# Altium schematic sheet A7_FUNCTION3 - Ⅱ.SchDoc
size A3
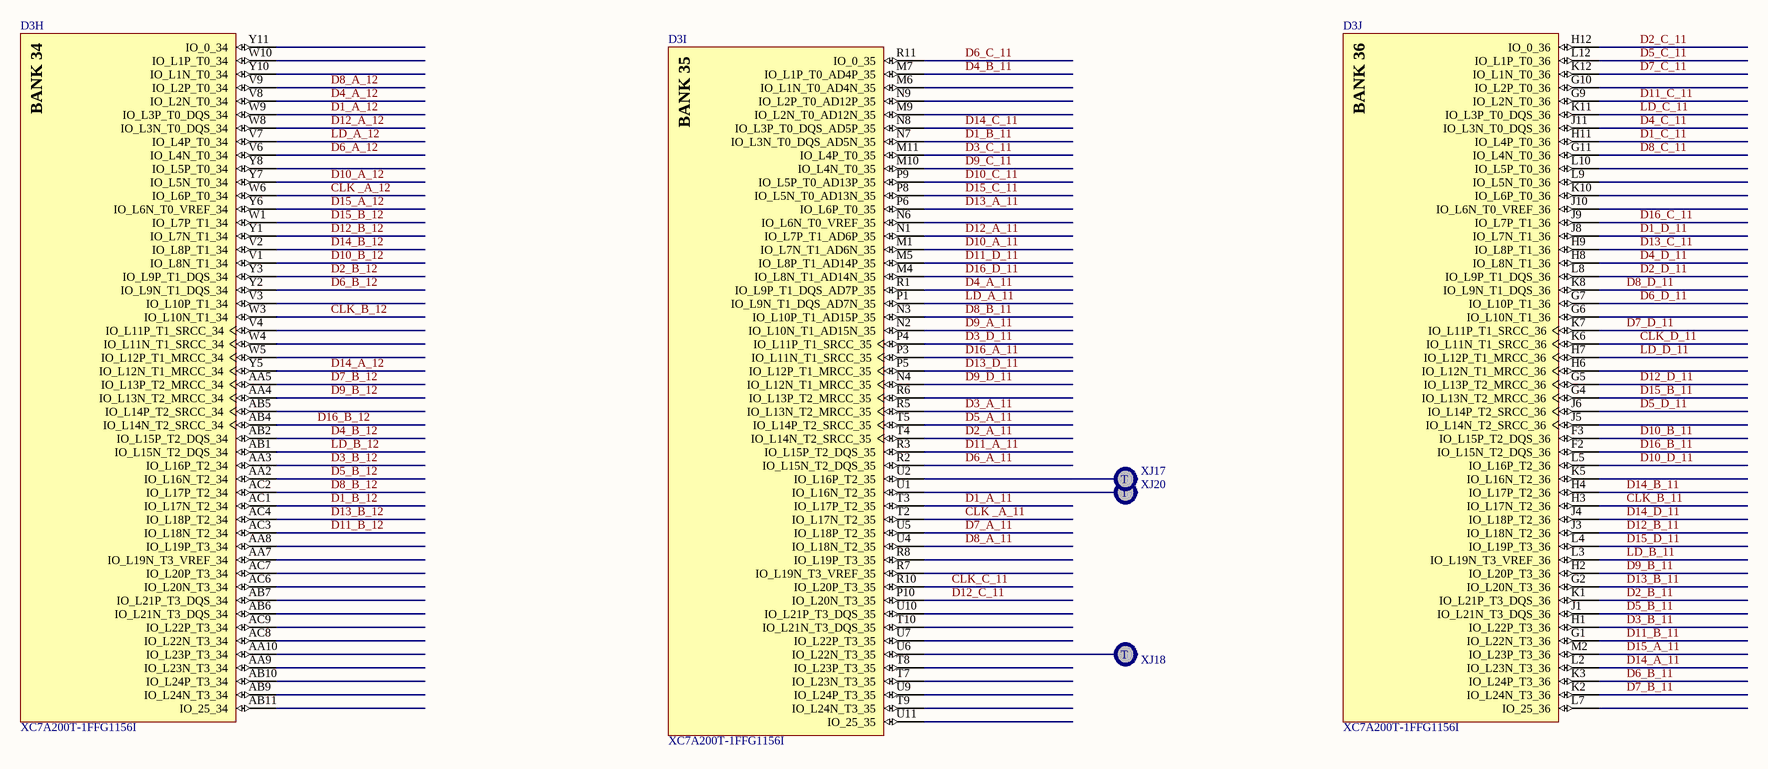
[diagram p0: A7_FUNCTION3 - Ⅱ.SchDoc]

## Parts
D3  XC7A200T-1FFG1156I  [FFG1156]  (parts H,I,J of 18)
XJ17  TESTPOINT  [TEST-pin]  (value not drawn)
XJ18  TESTPOINT  [TEST-pin]  (value not drawn)
XJ20  TESTPOINT  [TEST-pin]  (value not drawn)

## Nets
CLK _A_11: D3.T2(IO_L17N_T2_35)
CLK _A_12: D3.W6(IO_L6P_T0_34)
CLK_B_11: D3.H3(IO_L17N_T2_36)
CLK_B_12: D3.W3(IO_L10N_T1_34)
CLK_C_11: D3.R10(IO_L20P_T3_35)
CLK_D_11: D3.K6(IO_L11N_T1_SRCC_36)
D1_A_11: D3.T3(IO_L17P_T2_35)
D1_A_12: D3.W9(IO_L3P_T0_DQS_34)
D1_B_11: D3.N7(IO_L3N_T0_DQS_AD5N_35)
D1_B_12: D3.AC1(IO_L17N_T2_34)
D1_C_11: D3.H11(IO_L4P_T0_36)
D1_D_11: D3.J8(IO_L7N_T1_36)
D2_A_11: D3.T4(IO_L14N_T2_SRCC_35)
D2_B_11: D3.K1(IO_L21P_T3_DQS_36)
D2_B_12: D3.Y3(IO_L9P_T1_DQS_34)
D2_C_11: D3.H12(IO_0_36)
D2_D_11: D3.L8(IO_L9P_T1_DQS_36)
D3_A_11: D3.R5(IO_L13N_T2_MRCC_35)
D3_B_11: D3.H1(IO_L22P_T3_36)
D3_B_12: D3.AA3(IO_L16P_T2_34)
D3_C_11: D3.M11(IO_L4P_T0_35)
D3_D_11: D3.P4(IO_L11P_T1_SRCC_35)
D4_A_11: D3.R1(IO_L9P_T1_DQS_AD7P_35)
D4_A_12: D3.V8(IO_L2N_T0_34)
D4_B_11: D3.M7(IO_L1P_T0_AD4P_35)
D4_B_12: D3.AB2(IO_L15P_T2_DQS_34)
D4_C_11: D3.J11(IO_L3N_T0_DQS_36)
D4_D_11: D3.H8(IO_L8N_T1_36)
D5_A_11: D3.T5(IO_L14P_T2_SRCC_35)
D5_B_11: D3.J1(IO_L21N_T3_DQS_36)
D5_B_12: D3.AA2(IO_L16N_T2_34)
D5_C_11: D3.L12(IO_L1P_T0_36)
D5_D_11: D3.J6(IO_L14P_T2_SRCC_36)
D6_A_11: D3.R2(IO_L15N_T2_DQS_35)
D6_A_12: D3.V6(IO_L4N_T0_34)
D6_B_11: D3.K3(IO_L24P_T3_36)
D6_B_12: D3.Y2(IO_L9N_T1_DQS_34)
D6_C_11: D3.R11(IO_0_35)
D6_D_11: D3.G7(IO_L10P_T1_36)
D7_A_11: D3.U5(IO_L18P_T2_35)
D7_B_11: D3.K2(IO_L24N_T3_36)
D7_B_12: D3.AA5(IO_L13P_T2_MRCC_34)
D7_C_11: D3.K12(IO_L1N_T0_36)
D7_D_11: D3.K7(IO_L11P_T1_SRCC_36)
D8_A_11: D3.U4(IO_L18N_T2_35)
D8_A_12: D3.V9(IO_L2P_T0_34)
D8_B_11: D3.N3(IO_L10P_T1_AD15P_35)
D8_B_12: D3.AC2(IO_L17P_T2_34)
D8_C_11: D3.G11(IO_L4N_T0_36)
D8_D_11: D3.K8(IO_L9N_T1_DQS_36)
D9_A_11: D3.N2(IO_L10N_T1_AD15N_35)
D9_B_11: D3.H2(IO_L20P_T3_36)
D9_B_12: D3.AA4(IO_L13N_T2_MRCC_34)
D9_C_11: D3.M10(IO_L4N_T0_35)
D9_D_11: D3.N4(IO_L12N_T1_MRCC_35)
D10_A_11: D3.M1(IO_L7N_T1_AD6N_35)
D10_A_12: D3.Y7(IO_L5N_T0_34)
D10_B_11: D3.F3(IO_L15P_T2_DQS_36)
D10_B_12: D3.V1(IO_L8N_T1_34)
D10_C_11: D3.P9(IO_L5P_T0_AD13P_35)
D10_D_11: D3.L5(IO_L16P_T2_36)
D11_A_11: D3.R3(IO_L15P_T2_DQS_35)
D11_B_11: D3.G1(IO_L22N_T3_36)
D11_B_12: D3.AC3(IO_L18N_T2_34)
D11_C_11: D3.G9(IO_L2N_T0_36)
D11_D_11: D3.M5(IO_L8P_T1_AD14P_35)
D12_A_11: D3.N1(IO_L7P_T1_AD6P_35)
D12_A_12: D3.W8(IO_L3N_T0_DQS_34)
D12_B_11: D3.J3(IO_L18N_T2_36)
D12_B_12: D3.Y1(IO_L7N_T1_34)
D12_C_11: D3.P10(IO_L20N_T3_35)
D12_D_11: D3.G5(IO_L13P_T2_MRCC_36)
D13_A_11: D3.P6(IO_L6P_T0_35)
D13_B_11: D3.G2(IO_L20N_T3_36)
D13_B_12: D3.AC4(IO_L18P_T2_34)
D13_C_11: D3.H9(IO_L8P_T1_36)
D13_D_11: D3.P5(IO_L12P_T1_MRCC_35)
D14_A_11: D3.L2(IO_L23N_T3_36)
D14_A_12: D3.Y5(IO_L12N_T1_MRCC_34)
D14_B_11: D3.H4(IO_L17P_T2_36)
D14_B_12: D3.V2(IO_L8P_T1_34)
D14_C_11: D3.N8(IO_L3P_T0_DQS_AD5P_35)
D14_D_11: D3.J4(IO_L18P_T2_36)
D15_A_11: D3.M2(IO_L23P_T3_36)
D15_A_12: D3.Y6(IO_L6N_T0_VREF_34)
D15_B_11: D3.G4(IO_L13N_T2_MRCC_36)
D15_B_12: D3.W1(IO_L7P_T1_34)
D15_C_11: D3.P8(IO_L5N_T0_AD13N_35)
D15_D_11: D3.L4(IO_L19P_T3_36)
D16_A_11: D3.P3(IO_L11N_T1_SRCC_35)
D16_B_11: D3.F2(IO_L15N_T2_DQS_36)
D16_B_12: D3.AB4(IO_L14N_T2_SRCC_34)
D16_C_11: D3.J9(IO_L7P_T1_36)
D16_D_11: D3.M4(IO_L8N_T1_AD14N_35)
LD_A_11: D3.P1(IO_L9N_T1_DQS_AD7N_35)
LD_A_12: D3.V7(IO_L4P_T0_34)
LD_B_11: D3.L3(IO_L19N_T3_VREF_36)
LD_B_12: D3.AB1(IO_L15N_T2_DQS_34)
LD_C_11: D3.K11(IO_L3P_T0_DQS_36)
LD_D_11: D3.H7(IO_L12P_T1_MRCC_36)
NetD3_U1: D3.U1(IO_L16N_T2_35) XJ20.1(T)
NetD3_U2: D3.U2(IO_L16P_T2_35) XJ17.1(T)
NetD3_U6: D3.U6(IO_L22N_T3_35) XJ18.1(T)

Not connected (* = marked no-connect by the designer): D3 AA7(IO_L19N_T3_VREF_34) AA8(IO_L19P_T3_34) AA9(IO_L23N_T3_34) AA10(IO_L23P_T3_34) AB5(IO_L14P_T2_SRCC_34) AB6(IO_L21N_T3_DQS_34) AB7(IO_L21P_T3_DQS_34) AB9(IO_L24N_T3_34) AB10(IO_L24P_T3_34) AB11(IO_25_34) AC6(IO_L20N_T3_34) AC7(IO_L20P_T3_34) AC8(IO_L22N_T3_34) AC9(IO_L22P_T3_34) G6(IO_L10N_T1_36) G10(IO_L2P_T0_36) H6(IO_L12N_T1_MRCC_36) J5(IO_L14N_T2_SRCC_36) J10(IO_L6N_T0_VREF_36) K5(IO_L16N_T2_36) K10(IO_L6P_T0_36) L7(IO_25_36) L9(IO_L5N_T0_36) L10(IO_L5P_T0_36) M6(IO_L1N_T0_AD4N_35) M9(IO_L2N_T0_AD12N_35) N6(IO_L6N_T0_VREF_35) N9(IO_L2P_T0_AD12P_35) R6(IO_L13P_T2_MRCC_35) R7(IO_L19N_T3_VREF_35) R8(IO_L19P_T3_35) T7(IO_L23N_T3_35) T8(IO_L23P_T3_35) T9(IO_L24N_T3_35) T10(IO_L21N_T3_DQS_35) U7(IO_L22P_T3_35) U9(IO_L24P_T3_35) U10(IO_L21P_T3_DQS_35) U11(IO_25_35) V3(IO_L10P_T1_34) V4(IO_L11P_T1_SRCC_34) W4(IO_L11N_T1_SRCC_34) W5(IO_L12P_T1_MRCC_34) W10(IO_L1P_T0_34) Y8(IO_L5P_T0_34) Y10(IO_L1N_T0_34) Y11(IO_0_34)

## Notes on the sheet
- (in symbol XC7A200T-1FFG1156I, part H) BANK 34
- (in symbol XC7A200T-1FFG1156I, part I) BANK 35
- (in symbol XC7A200T-1FFG1156I, part J) BANK 36

## Library data of the parts
D3 = XC7A200T-1FFG1156I: Artix-7 FPGA, 500 User I/Os, 16 GTP, 1156-Ball BGA, Speed Grade 1, Industrial Grade, Pb-Free; Manufacturer: Xilinx; Block RAM Blocks (18Kb): 730; Block RAM Blocks (36Kb): 365; Block RAM Blocks (Max Kb): 13140; CLBs (Slices): 33650; Clock Mgmt Tiles (CMTs): 10; DSP48E1 Slices: 740; Logic Cells: 215360; Max User I/O: 500; Speed Grade: -1; DatasheetVersion: v1.12; PackageVersion: Rev 1.8; PackageReference: FFG1156; PackageDescription: Flip-Chip BGA, Body 35 x 35 mm, 1.0 mm Pitch; CLBs (Max Distributed RAM Kb): 2888; Generic Part Number: XC7A200T; RoHS: Pb-Free; Mounting Technology: Surface Mount; Code_JEDEC: MS-034-AAR-1; PartNumber: XC7A200T-1FFG1156I; ComponentLink1Description: Datasheet; ComponentLink1URL: http://www.xilinx.com/support/documentation/data_sheets/ds180_7Series_Overview.pdf; ComponentLink2Description: Package Specification; ComponentLink2URL: http://www.xilinx.com/support/documentation/user_guides/ug475_7Series_Pkg_Pinout.pdf; ComponentLink3Description: DC and Switching Characteristics; ComponentLink3URL: http://www.xilinx.com/support/documentation/data_sheets/ds181_Artix_7_Data_Sheet.pdf; ComponentLink4Description: Package File; ComponentLink4URL: http://www.xilinx.com/support/packagefiles/a7packages/xc7a200tfbg676pkg.txt; ComponentLink5Description: Packaging and Pinout; ComponentLink5URL: http://www.xilinx.com/support/documentation/user_guides/ug475_7Series_Pkg_Pinout.pdf
XJ17 XJ18 XJ20 = TESTPOINT: 测试点; Part_type: Miscellaneous; Part_number: TESTPOINT; Value: TESTPOINT; Schematic_Part: TESTPOINT; PCB_Footprint: TEST-pin